# EAGLE schematic singleInverter (EAGLE 9.6.2)
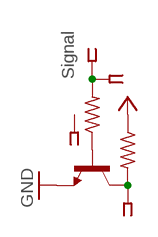
[diagram p0: schematic, sheet 1]

## Parts
NO_INVERT_JUMPER2  SSW-103-02-G-S  [SSW-103-02-G-S]
R4  ~220  R-US_0204/7  [0204/7]
R5  ~220  R-US_0204/7  [0204/7]
SIGS_IN  SSW-106-02-G-D  [SSW-106-02-G-D]
T3  2N3565  [TO92]

## Nets
GND: T3.3(E)
N$13: R4.1 T3.2(B)
N$14: NO_INVERT_JUMPER2.2 R4.2 SIGS_IN.8
N$17: NO_INVERT_JUMPER2.3 R5.2 T3.1(C)
VCC: R5.1
Unconnected: NO_INVERT_JUMPER2.1 SIGS_IN.1 SIGS_IN.2 SIGS_IN.3 SIGS_IN.4 SIGS_IN.5 SIGS_IN.6 SIGS_IN.7 SIGS_IN.9 SIGS_IN.10 SIGS_IN.11 SIGS_IN.12

## Notes on the sheet
- Signal

## Library data of the parts
NO_INVERT_JUMPER2 = con-samtec:SSW-103-02-G-S: THROUGH-HOLE .025" SQ POST SOCKET Source: Samtec SSW.pdf; MF: Samtec Inc.; MPN: SSW-103-02-G-S; OC_FARNELL: unknown; OC_NEWARK: 11P9367
R4 R5 = rcl:R-US_: RESISTOR, American symbol; SPICEPREFIX: R
SIGS_IN = con-samtec:SSW-106-02-G: THROUGH-HOLE .025" SQ POST SOCKET Source: Samtec SSW.pdf; MF: Samtec Inc.; MPN: SSW-106-02-G-D; OC_FARNELL: unknown; OC_NEWARK: 11P9414
T3 = transistor:2N3565: NPN TRANSISTOR